# Altium schematic sheet 继电器程控放大V2_3级.SchDoc
size A4
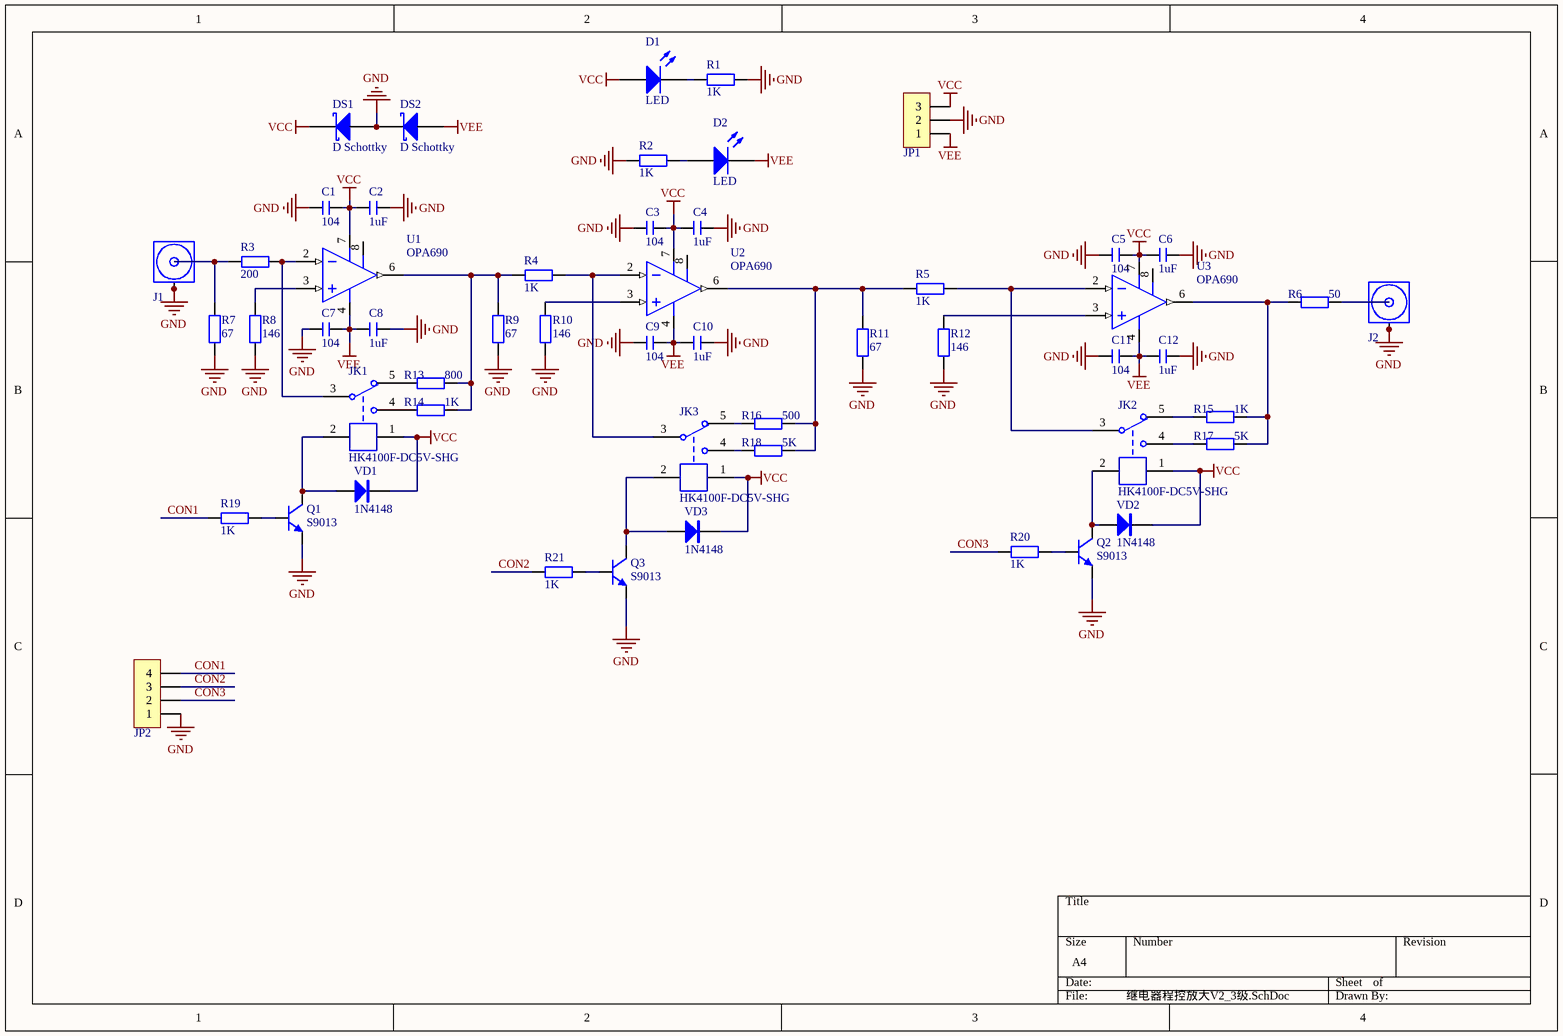
[diagram p0: 继电器程控放大V2_3级.SchDoc]

## Parts
C1  104  [C 0603]
C2  1uF  [C 0603]
C3  104  [C 0603]
C4  1uF  [C 0603]
C5  104  [C 0603]
C6  1uF  [C 0603]
C7  104  [C 0603]
C8  1uF  [C 0603]
C9  104  [C 0603]
C10  1uF  [C 0603]
C11  104  [C 0603]
C12  1uF  [C 0603]
D1  LED  [LED_0805]
D2  LED  [LED_0805]
DS1  D Schottky  [DIODE-SMA]
DS2  D Schottky  [DIODE-SMA]
J1  COAX  [MCX5.08-5-H]  (value not drawn)
J2  COAX  [MCX5.08-5-H]  (value not drawn)
JK1  HK4100F-DC5V-SHG  [HK4100F]
JK2  HK4100F-DC5V-SHG  [HK4100F]
JK3  HK4100F-DC5V-SHG  [HK4100F]
JP1  HDR-1X3  [XH2.54-3P_H]  (value not drawn)
JP2  HDR-1X4  [HDR-1X4]  (value not drawn)
Q1  S9013  [SOT23-3N]
Q2  S9013  [SOT23-3N]
Q3  S9013  [SOT23-3N]
R1  1K  [R 0805]
R2  1K  [R 0805]
R3  200  [R 0603]
R4  1K  [R 0603]
R5  1K  [R 0603]
R6  50  [R 0603]
R7  67  [R 0603]
R8  146  [R 0603]
R9  67  [R 0603]
R10  146  [R 0603]
R11  67  [R 0603]
R12  146  [R 0603]
R13  800  [R 0603]
R14  1K  [R 0603]
R15  1K  [R 0603]
R16  500  [R 0603]
R17  5K  [R 0603]
R18  5K  [R 0603]
R19  1K  [R 0603]
R20  1K  [R 0603]
R21  1K  [R 0603]
U1  OPA690  [SOIC8_N]
U2  OPA690  [SOIC8_N]
U3  OPA690  [SOIC8_N]
VD1  1N4148  [SOD-323]
VD2  1N4148  [SOD-323]
VD3  1N4148  [SOD-323]

## Nets
GND: C1.1 C2.2 C3.1 C4.2 C5.1 C6.2 C7.1 C8.2 C9.1 C10.2 C11.1 C12.2 DS1.1 DS2.2 J1.2(GND) J1.3(GND) J1.4(GND) J1.5(GND) J2.2(GND) J2.3(GND) J2.4(GND) J2.5(GND) JP1.2 JP2.1 Q1.2(E) Q2.2(E) Q3.2(E) R1.2 R2.1 R7.2 R8.1 R9.2 R10.2 R11.2 R12.2
VCC: C1.2 C2.1 C3.2 C4.1 C5.2 C6.1 D1.1(A) DS1.2 JK1.1 JK2.1 JK3.1 JP1.3 U1.7(V+) U2.7(V+) U3.7(V+) VD1.2(K) VD2.2(K) VD3.2(K)
VEE: C7.2 C8.1 C9.2 C10.1 C11.2 C12.1 D2.2(K) DS2.1 JP1.1 U1.4(V-) U2.4(V-) U3.4(V-)
CON1: JP2.4 R19.1
CON2: JP2.3 R21.1
CON3: JP2.2 R20.1
NetD1_2: D1.2(K) R1.1
NetD2_1: D2.1(A) R2.2
NetJ1_1: J1.1(Signal) R3.2 R7.1
NetJ2_1: J2.1(Signal) R6.1
NetJK1_2: JK1.2 Q1.3(C) VD1.1(A)
NetJK1_3: JK1.3 R3.1 U1.2(IN-)
NetJK1_4: JK1.4 R14.1
NetJK1_5: JK1.5 R13.1
NetJK2_2: JK2.2 Q2.3(C) VD2.1(A)
NetJK2_3: JK2.3 R5.1 U3.2(IN-)
NetJK2_4: JK2.4 R17.2
NetJK2_5: JK2.5 R15.2
NetJK3_2: JK3.2 Q3.3(C) VD3.1(A)
NetJK3_3: JK3.3 R4.1 U2.2(IN-)
NetJK3_4: JK3.4 R18.2
NetJK3_5: JK3.5 R16.2
NetQ1_1: Q1.1(B) R19.2
NetQ2_1: Q2.1(B) R20.2
NetQ3_1: Q3.1(B) R21.2
NetR4_2: R4.2 R9.1 R13.2 R14.2 U1.6(OUT)
NetR5_2: R5.2 R11.1 R16.1 R18.1 U2.6(OUT)
NetR6_2: R6.2 R15.1 R17.1 U3.6(OUT)
NetR8_2: R8.2 U1.3(IN+)
NetR10_1: R10.1 U2.3(IN+)
NetR12_1: R12.1 U3.3(IN+)

Not connected (* = marked no-connect by the designer): U1 8(DIS); U2 8(DIS); U3 8(DIS)

## Library data of the parts
C1-C12 = C: 无极性贴片电容; 版权归属: 源创客; BOM名称: 无极性贴片电容; 学习资源: www.ooocke.com
D1 D2 = LED: 发光二极管; Published: 8-Jun-2000; LatestRevisionDate: 08-Jul-2005; LatestRevisionNote: Mech Layer 1 removed.; PackageReference: LED; Publisher: Altium Limited
DS1 DS2 = D Schottky: Schottky Diode; Published: 8-Jun-2000; LatestRevisionDate: 17-Jul-2002; LatestRevisionNote: Re-released for DXP Platform.; PackageReference: SMB; Publisher: Altium Limited; PackageDescription: DO-214-AA/SMB; 2 C-Bend Leads; Body 5.3 x 3.6 mm, inc. leads (LxW); Code_JEDEC: DO-214-AA
JK1-JK3 = HK4100F: 单路双控继电器; 版权归属: 源创客; BOM名称: 单路双控继电器; 学习资源: www.ooocke.com
JP1 = Header 3: 3P接插件; 版权归属: 源创客; BOM名称: 3P接插件; 学习资源: www.ooocke.com
JP2 = Header 4: 4P接插件; 版权归属: 源创客; BOM名称: 4P接插件; 学习资源: www.ooocke.com
Q1-Q3 = 9013-SMD: 低频放大-NPN型; 版权归属: 源创客; 属性: 50V 0.5A 0.625W; BOM名称: 低频放大-NPN型; 学习资源: www.ooocke.com
R1-R21 = R: 贴片电阻; 版权归属: 源创客; BOM名称: 贴片电阻; 学习资源: www.ooocke.com
U1-U3 = OPA690ID: 具有禁用功能的宽带电压反馈运算放大器
VD1-VD3 = 1N4148: 高速开关二极管; 版权归属: 源创客; BOM名称: 高速开关二极管; 学习资源: www.ooocke.com